# EAGLE design Volt Shield 1.0 (EAGLE 5.11)

## Sheet 1 of 3
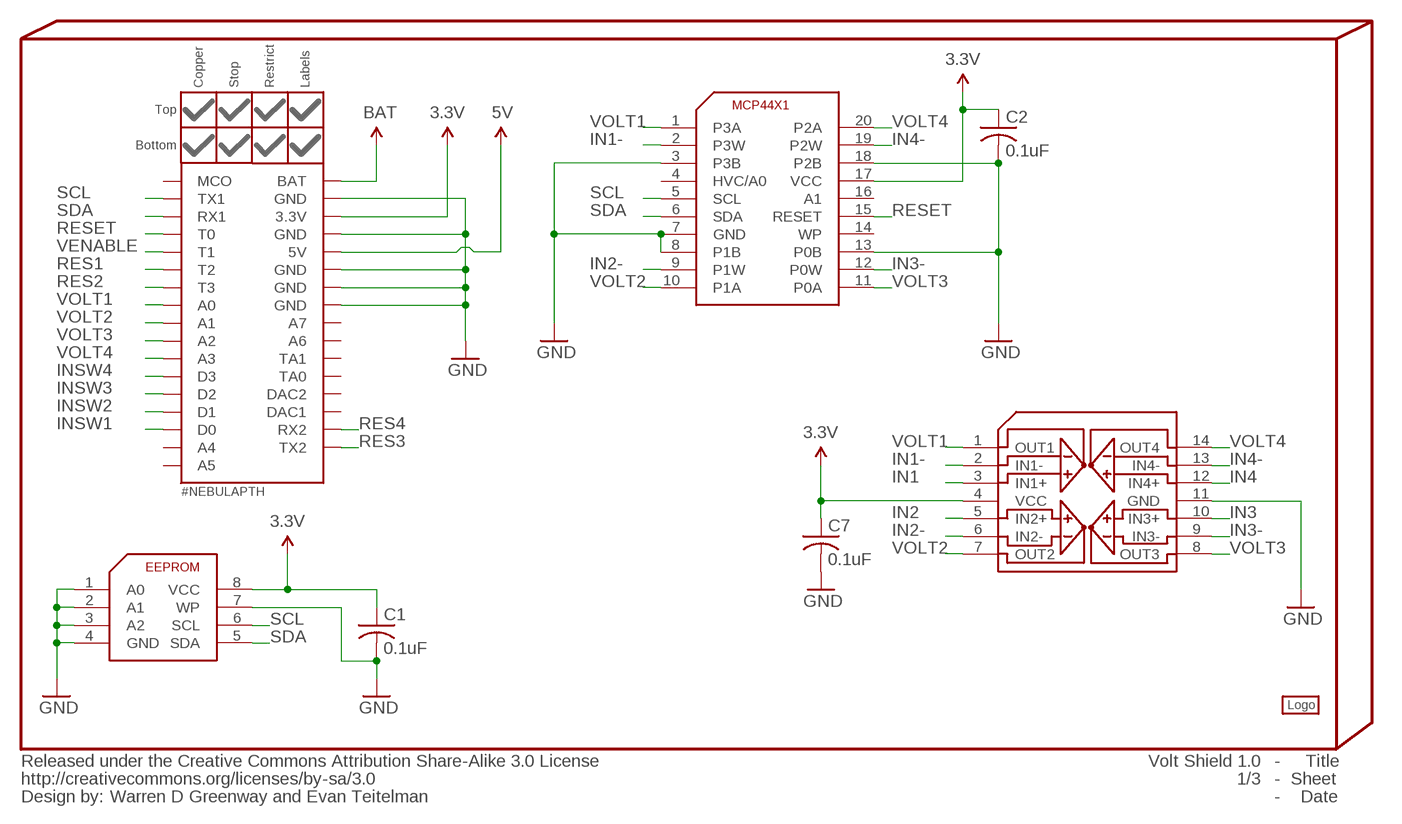
[diagram p0: schematic, sheet 1]

### Parts
C1  0.1uF  C-USC0402  [C0402]
C2  0.1uF  C-USC0402  [C0402]
C7  0.1uF  C-USC0402  [C0402]
INFO2  Warren D Greenway and Evan Teitelman  %CC-BY-SA  [%CC-BY-SA]
LOGO1  #PYGMYLOGONORMAL  #PYGMYLOGOLARGE  [#PYGMYLOGO]
NEBULA1  #NEBULAPTH  [#NEBULA-PTH]
U2  DIGIPOT-MCP44X1  [TSSOP20]
U3  EEPROM-ATMEL-AT24HC02B  [TSSOP8]
U8  OPAMP-ST-LMV324ID  [SO-14]

### Nets
3.3V: C1.1 C2.1 C7.1 NEBULA1.3.3V U2.17(VCC) U3.8(VCC) U8.4(VCC) ; supply symbol labelled @3.3V ; also sheet 2
5V: NEBULA1.5V ; supply symbol labelled @5V
BAT: NEBULA1.BAT ; supply symbol labelled @BAT ; also sheet 3
GND: C1.2 C2.2 C7.2 NEBULA1.GND1(GND) NEBULA1.GND2(GND) NEBULA1.GND3(GND) NEBULA1.GND4(GND) NEBULA1.GND5(GND) U2.3(P3B) U2.7(GND) U2.8(P1B) U2.13(P0B) U2.18(P2B) U3.1(A0) U3.2(A1) U3.3(A2) U3.4(GND) U3.7(WP) U8.11(GND) ; supply symbol labelled @GND ; also sheet 2,3
IN1: U8.3(IN1+) ; also sheet 2
IN1-: U2.2(P3W) U8.2(IN1-)
IN2: U8.5(IN2+) ; also sheet 2
IN2-: U2.9(P1W) U8.6(IN2-)
IN3: U8.10(IN3+) ; also sheet 2
IN3-: U2.12(P0W) U8.9(IN3-)
IN4: U8.12(IN4+) ; also sheet 2
IN4-: U2.19(P2W) U8.13(IN4-)
INSW1: NEBULA1.D0 ; also sheet 2
INSW2: NEBULA1.D1 ; also sheet 2
INSW3: NEBULA1.D2 ; also sheet 2
INSW4: NEBULA1.D3 ; also sheet 2
RES1: NEBULA1.T2 ; also sheet 2
RES2: NEBULA1.T3 ; also sheet 2
RES3: NEBULA1.COM2_TX(TX2) ; also sheet 2
RES4: NEBULA1.COM2_RX(RX2) ; also sheet 2
RESET: NEBULA1.T0 U2.15(RESET)
SCL: NEBULA1.COM1_TX(TX1) U2.5(SCL) U3.6(SCL)
SDA: NEBULA1.COM1_RX(RX1) U2.6(SDA) U3.5(SDA)
VENABLE: NEBULA1.T1 ; also sheet 3
VOLT1: NEBULA1.A0 U2.1(P3A) U8.1(OUT1)
VOLT2: NEBULA1.A1 U2.10(P1A) U8.7(OUT2)
VOLT3: NEBULA1.A2 U2.11(P0A) U8.8(OUT3)
VOLT4: NEBULA1.A3 U2.20(P2A) U8.14(OUT4)
Unconnected: NEBULA1.A4 NEBULA1.A5 NEBULA1.A6 NEBULA1.A7 NEBULA1.DAC1 NEBULA1.DAC2 NEBULA1.MCO NEBULA1.TA0 NEBULA1.TA1 U2.4(HVC/A0) U2.14(WP) U2.16(A1)

## Sheet 2 of 3
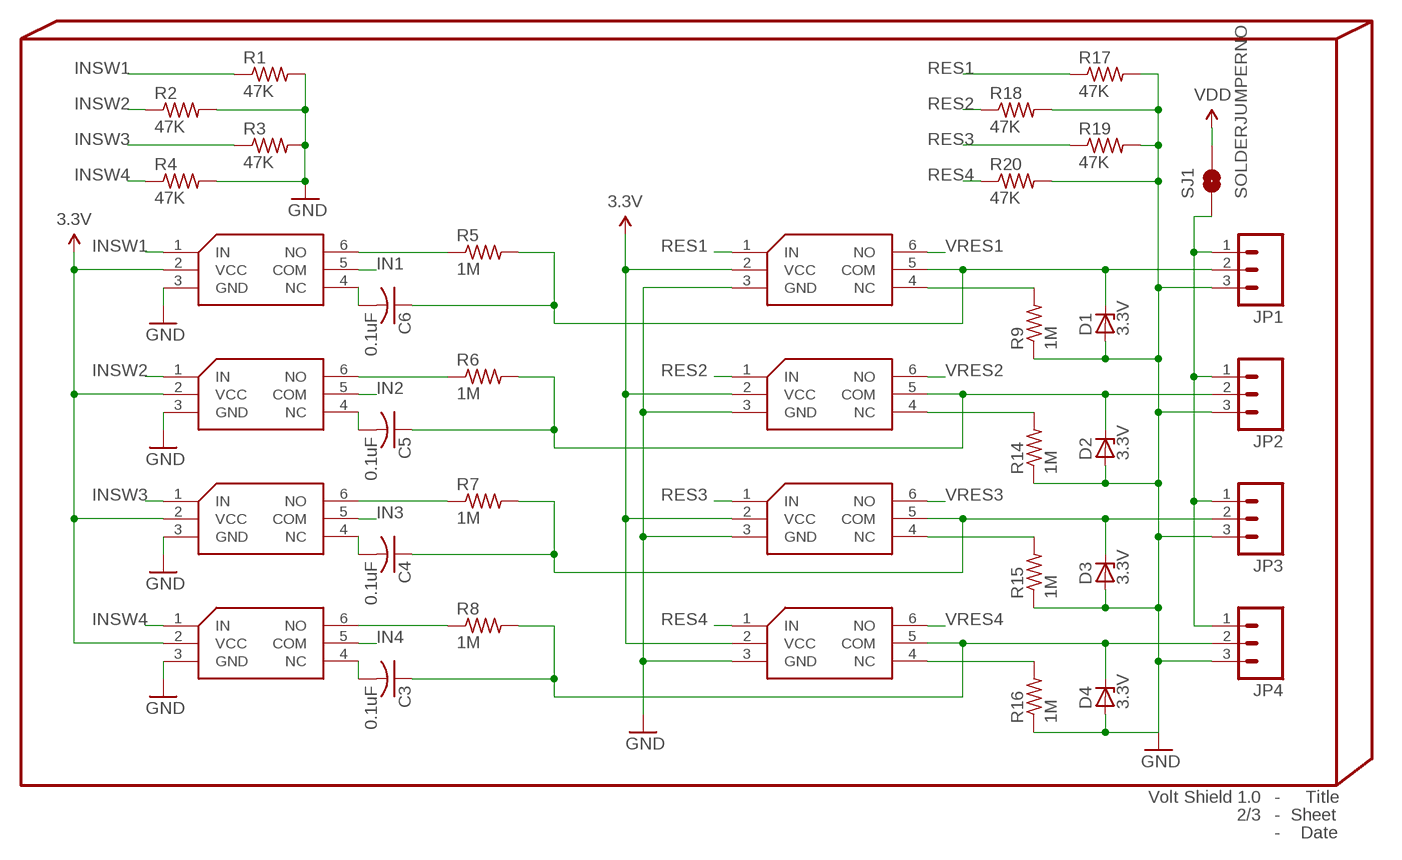
[diagram p1: schematic, sheet 2]

### Parts
C3  0.1uF  C-USC0402  [C0402]
C4  0.1uF  C-USC0402  [C0402]
C5  0.1uF  C-USC0402  [C0402]
C6  0.1uF  C-USC0402  [C0402]
D1  3.3V  ZENER-DIODESOD80C  [SOD80C]
D2  3.3V  ZENER-DIODESOD80C  [SOD80C]
D3  3.3V  ZENER-DIODESOD80C  [SOD80C]
D4  3.3V  ZENER-DIODESOD80C  [SOD80C]
JP1  M03JST-PTH  [JST-3-PTH]
JP2  M03JST-PTH  [JST-3-PTH]
JP3  M03JST-PTH  [JST-3-PTH]
JP4  M03JST-PTH  [JST-3-PTH]
R1  47K  R-US_R0402  [R0402]
R2  47K  R-US_R0402  [R0402]
R3  47K  R-US_R0402  [R0402]
R4  47K  R-US_R0402  [R0402]
R5  1M  R-US_R0402  [R0402]
R6  1M  R-US_R0402  [R0402]
R7  1M  R-US_R0402  [R0402]
R8  1M  R-US_R0402  [R0402]
R9  1M  R-US_R0402  [R0402]
R14  1M  R-US_R0402  [R0402]
R15  1M  R-US_R0402  [R0402]
R16  1M  R-US_R0402  [R0402]
R17  47K  R-US_R0402  [R0402]
R18  47K  R-US_R0402  [R0402]
R19  47K  R-US_R0402  [R0402]
R20  47K  R-US_R0402  [R0402]
SJ1  SOLDERJUMPERNO  [SJ_2S-NO]
U4  MULTIPLEXER-TI-TS5A4624  [SC70-6L]
U5  MULTIPLEXER-TI-TS5A4624  [SC70-6L]
U6  MULTIPLEXER-TI-TS5A4624  [SC70-6L]
U7  MULTIPLEXER-TI-TS5A4624  [SC70-6L]
U9  MULTIPLEXER-TI-TS5A4624  [SC70-6L]
U10  MULTIPLEXER-TI-TS5A4624  [SC70-6L]
U11  MULTIPLEXER-TI-TS5A4624  [SC70-6L]
U12  MULTIPLEXER-TI-TS5A4624  [SC70-6L]

### Nets
3.3V: U4.2(VCC) U5.2(VCC) U6.2(VCC) U7.2(VCC) U9.2(VCC) U10.2(VCC) U11.2(VCC) U12.2(VCC) ; supply symbol labelled @3.3V ; also sheet 1
GND: D1.A D2.A D3.A D4.A JP1.3 JP2.3 JP3.3 JP4.3 R1.2 R2.2 R3.2 R4.2 R9.1 R14.1 R15.1 R16.1 R17.2 R18.2 R19.2 R20.2 U4.3(GND) U5.3(GND) U6.3(GND) U7.3(GND) U9.3(GND) U10.3(GND) U11.3(GND) U12.3(GND) ; supply symbol labelled @GND ; also sheet 1,3
IN1: U4.5(COM) ; also sheet 1
IN2: U5.5(COM) ; also sheet 1
IN3: U6.5(COM) ; also sheet 1
IN4: U7.5(COM) ; also sheet 1
INSW1: R1.1 U4.1(IN) ; also sheet 1
INSW2: R2.1 U5.1(IN) ; also sheet 1
INSW3: R3.1 U6.1(IN) ; also sheet 1
INSW4: R4.1 U7.1(IN) ; also sheet 1
N$1: R5.1 U4.6(NO)
N$2: R6.1 U5.6(NO)
N$3: R7.1 U6.6(NO)
N$4: R8.1 U7.6(NO)
N$5: C3.2 U7.4(NC)
N$6: C4.2 U6.4(NC)
N$7: C6.1 D1.C JP1.2 R5.2 U9.5(COM)
N$8: JP1.1 JP2.1 JP3.1 JP4.1 SJ1.1
N$9: C5.1 D2.C JP2.2 R6.2 U10.5(COM)
N$12: C5.2 U5.4(NC)
N$13: C6.2 U4.4(NC)
N$16: C4.1 D3.C JP3.2 R7.2 U11.5(COM)
N$18: R16.2 U12.4(NC)
N$19: R15.2 U11.4(NC)
N$20: R14.2 U10.4(NC)
N$21: R9.2 U9.4(NC)
N$22: C3.1 D4.C JP4.2 R8.2 U12.5(COM)
RES1: R17.1 U9.1(IN) ; also sheet 1
RES2: R18.1 U10.1(IN) ; also sheet 1
RES3: R19.1 U11.1(IN) ; also sheet 1
RES4: R20.1 U12.1(IN) ; also sheet 1
VDD: SJ1.2 ; supply symbol labelled @VDD ; also sheet 3
VRES1: U9.6(NO) ; also sheet 3
VRES2: U10.6(NO) ; also sheet 3
VRES3: U11.6(NO) ; also sheet 3
VRES4: U12.6(NO) ; also sheet 3

## Sheet 3 of 3
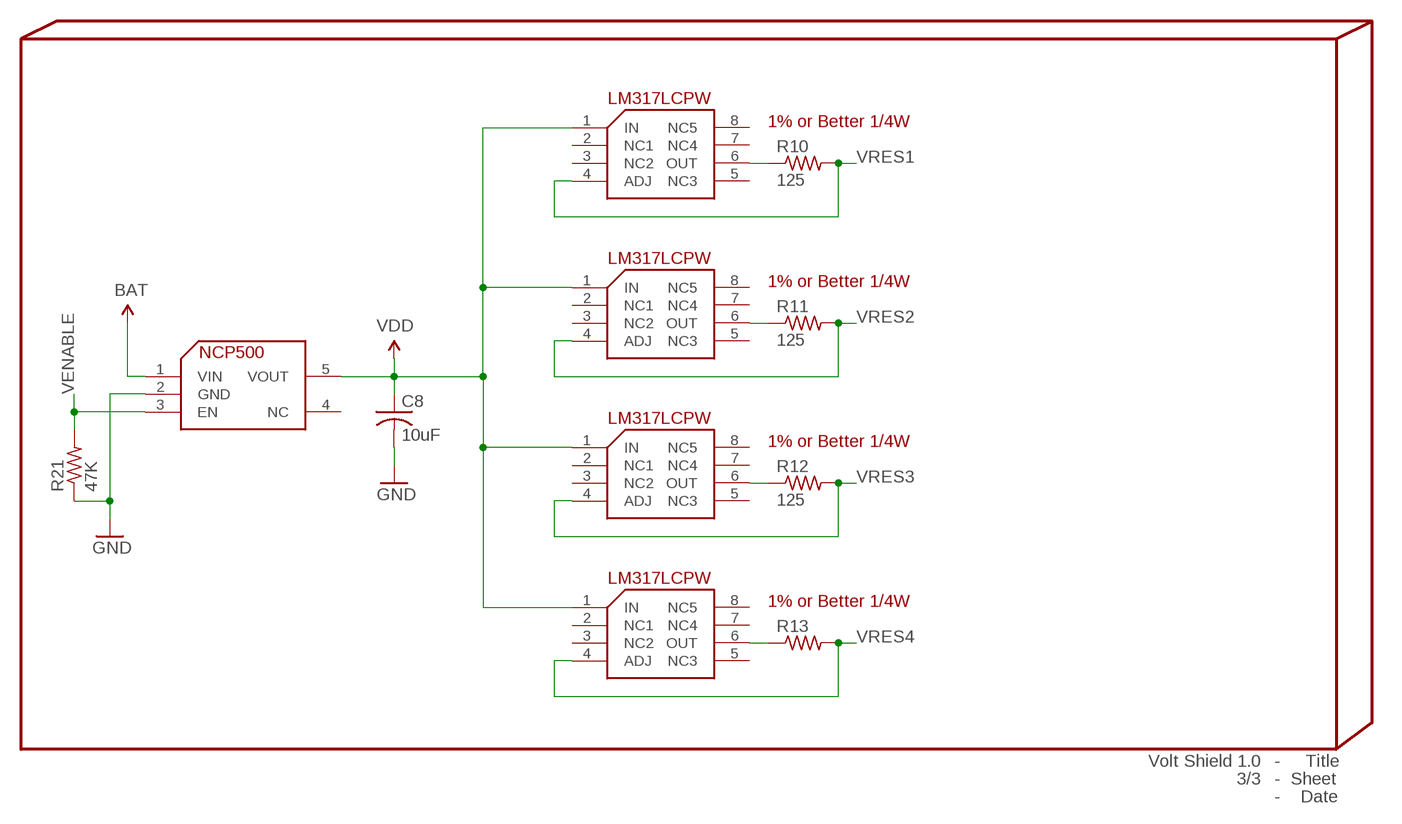
[diagram p2: schematic, sheet 3]

### Parts
C8  10uF  C-USC0805  [C0805]
R10  125  R-US_R1206  [R1206]
R11  125  R-US_R1206  [R1206]
R12  125  R-US_R1206  [R1206]
R13  R-US_R1206  [R1206]
R21  47K  R-US_R0402  [R0402]
U$13  NCP500  [SOT23-5L]
U$14  REGULATOR-TI-LM317LCPW  [TSSOP8]
U$15  REGULATOR-TI-LM317LCPW  [TSSOP8]
U$16  REGULATOR-TI-LM317LCPW  [TSSOP8]
U$17  REGULATOR-TI-LM317LCPW  [TSSOP8]

### Nets
BAT: U$13.1(VIN) ; supply symbol labelled @BAT ; also sheet 1
GND: C8.2 R21.1 U$13.2(GND) ; supply symbol labelled @GND ; also sheet 1,2
N$10: R10.1 U$14.6(OUT)
N$11: R11.1 U$15.6(OUT)
N$14: R12.1 U$16.6(OUT)
N$15: R13.1 U$17.6(OUT)
VDD: C8.1 U$13.5(VOUT) U$14.1(IN) U$15.1(IN) U$16.1(IN) U$17.1(IN) ; supply symbol labelled @VDD ; also sheet 2
VENABLE: R21.2 U$13.3(EN) ; also sheet 1
VRES1: R10.2 U$14.4(ADJ) ; also sheet 2
VRES2: R11.2 U$15.4(ADJ) ; also sheet 2
VRES3: R12.2 U$16.4(ADJ) ; also sheet 2
VRES4: R13.2 U$17.4(ADJ) ; also sheet 2
Unconnected: U$13.4(NC) U$14.2(NC1) U$14.3(NC2) U$14.5(NC3) U$14.7(NC4) U$14.8(NC5) U$15.2(NC1) U$15.3(NC2) U$15.5(NC3) U$15.7(NC4) U$15.8(NC5) U$16.2(NC1) U$16.3(NC2) U$16.5(NC3) U$16.7(NC4) U$16.8(NC5) U$17.2(NC1) U$17.3(NC2) U$17.5(NC3) U$17.7(NC4) U$17.8(NC5)

### Notes on the sheet
- 1% or Better 1/4W
- 1% or Better 1/4W
- 1% or Better 1/4W
- 1% or Better 1/4W

## Library data of the parts
C1-C8 = rcl:C-US: CAPACITOR, American symbol
D1-D4 = diode:ZENER-DIODE: Z-Diode
INFO2 = PygmyBoards:%CC-BY-SA: Creative Commons Attribution-ShareAlike License <http://creativecommons.org/licenses/by-sa/3.0/>
JP1-JP4 = Pygmy:M03: Header 3 Standard 3-pin 0.1" header. Use with straight break away headers (SKU : PRT-00116), right angle break away headers (PRT-00553), swiss pins (PRT-00743), machine pins (PRT-00117), and female headers (PRT-00115). Molex polarized connector foot print use with SKU : PRT-08232 with associated crimp pins and housings.
LOGO1 = Pygmy:#PYGMYLOGO
NEBULA1 = PygmyBoards:#NEBULA: Nebula Board and Shield Footprint Pads This is the only absolutely required part for the footprint. The parts in "#NEBULA-PART" are merely aesthetic. A circular board outline should be .001" thick and 1.005" in diameter (Reference circle on the Document (48) layer provided).
R1-R21 = rcl:R-US_: RESISTOR, American symbol
SJ1 = Pygmy:SOLDERJUMPER: Solder Jumper Standard SMD solder jumper. Used to automate production. Two varients : Normally Open and Normally Closed are the same, but have different paste layers. NC will have a large amount of paste and should jumper during reflow.
U2 = Pygmy:DIGIPOT-MCP44X1
U3 = Pygmy:EEPROM-ATMEL-AT24HC02B
U4-U7 U9-U12 = Pygmy:MULTIPLEXER-TI-TS5A4624
U8 = Pygmy:OPAMP-ST-LMV324ID
U$13 = Pygmy:NCP500
U$14-U$17 = Pygmy:REGULATOR-TI-LM317LCPW

## Board
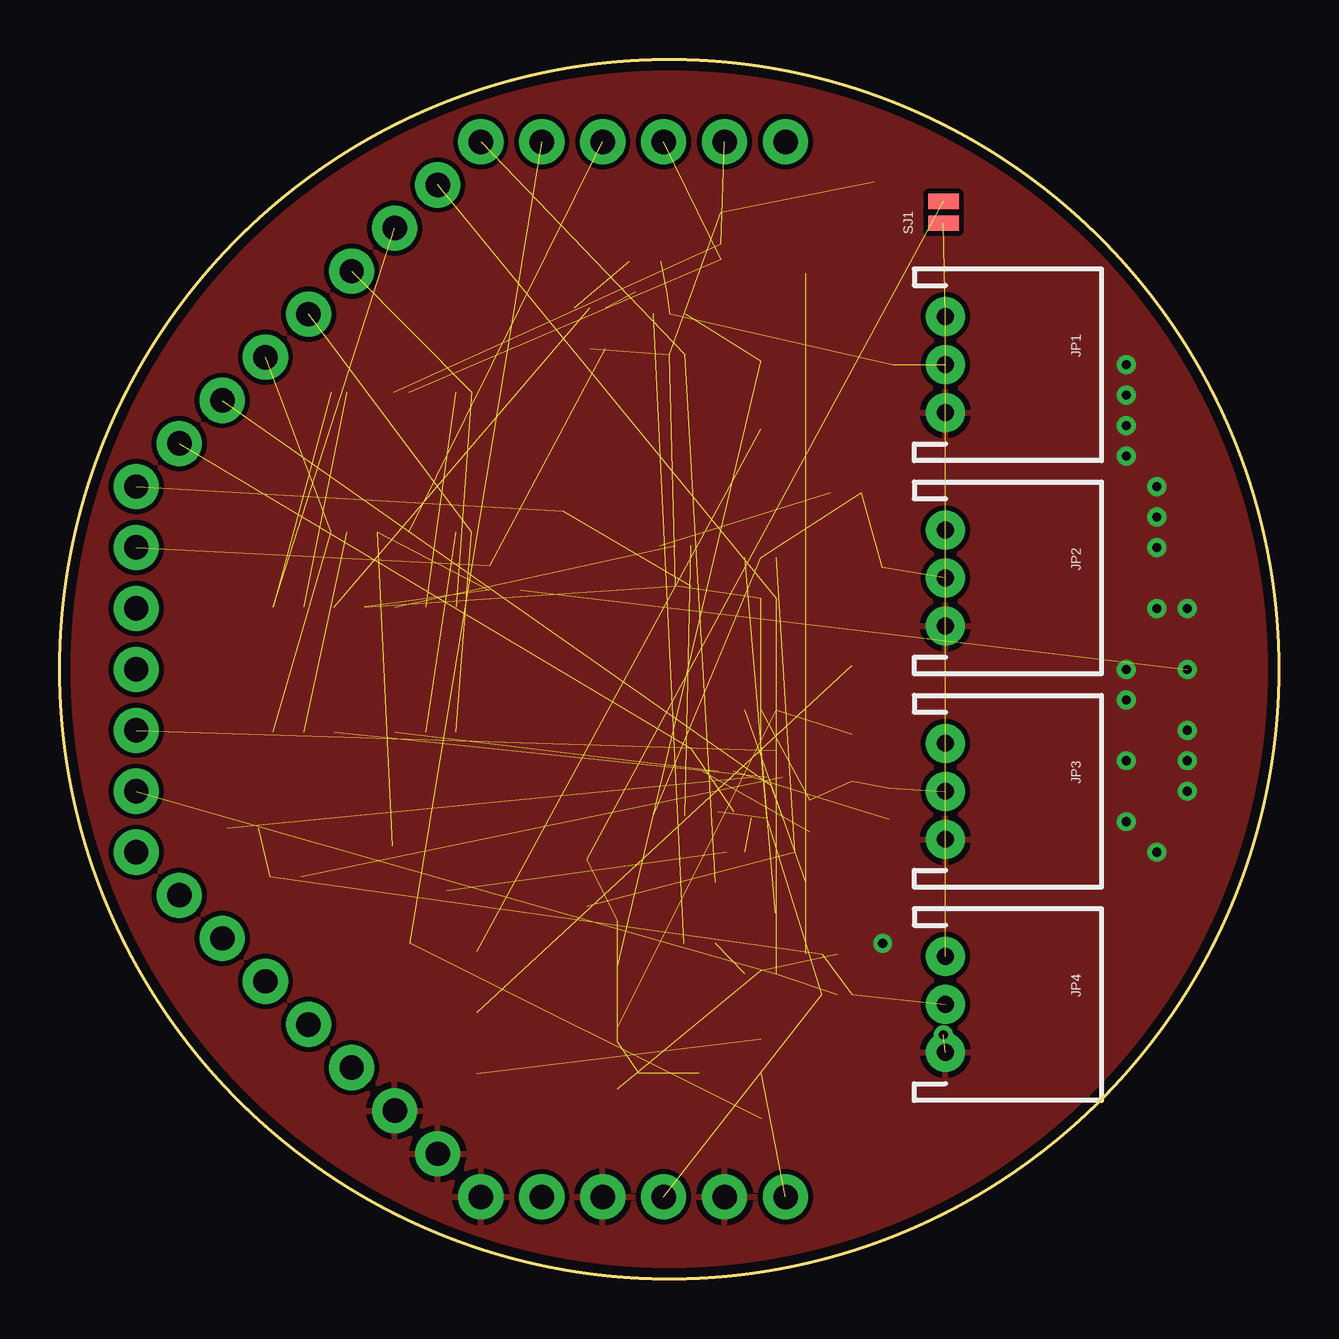
[diagram p3: board, top side]
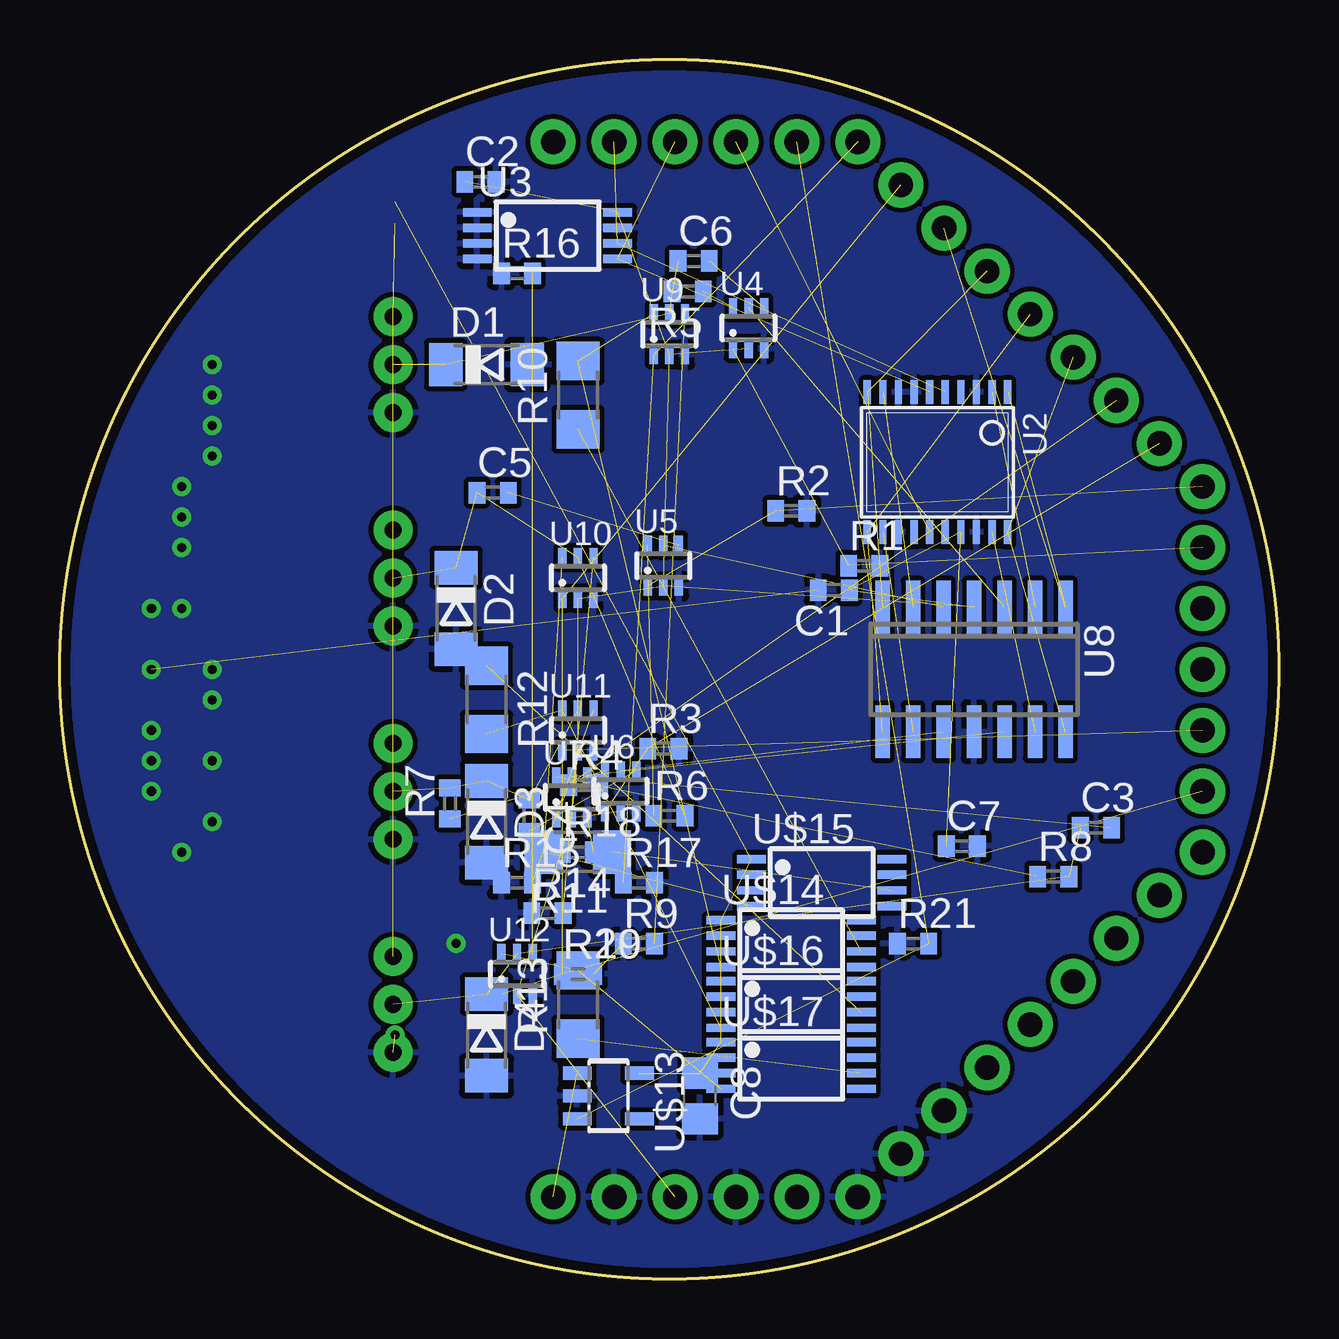
[diagram p4: board, bottom side, seen from below]

Size 50.8 x 50.8 mm. Coordinates in mm from the lower left corner, seen from the top.
Outline: circle at 25.4,25.4 radius 25.4
Copper layers (1*16): Top 0.035mm / dielectric 1.5mm / Bottom 0.035mm
Design rules "PDX (Production)": minimum track width 6mil, minimum drill 15mil, track to track 6mil, track to pad 6mil, pad to pad 4mil, via to via 6mil, smd to smd 4mil, copper to edge 15mil, drill to drill 6mil, minimum pad ring 10mil, minimum via ring 8mil, stop-mask expansion 4mil, vias tented up to drill 25mil, thermal gap 10mil

### Footprints (pad centres in the part's own frame; a part is rotated, then mirrored left to right if it is on the bottom)
C0402 = smd 0.7 x 0.9: 1 -0.65,0; 2 0.65,0
C0805 = smd 1.3 x 1.5: 1 -0.95,0; 2 0.95,0
SOD80C = smd 1.4 x 1.8: A 1.7,0; C -1.7,0
JST-3-PTH = drill 0.7 pad 1.626 round: 1 -2,-5; 2 0,-5; 3 2,-5
#NEBULA-PTH@1 = drill 1.016 pad 1.88 round: 3.3V -25.637,-47.388; 5V -30.716,-47.388; A0 -36.848,-7.004; A1 -38.645,-8.8; A2 -40.44,-10.596; A3 -42.237,-12.392; A4 -47.625,-22.86; A5 -47.625,-25.4; A6 -40.44,-40.204; A7 -38.645,-42; BAT -20.557,-47.388; COM1_RX -25.636,-3.412; COM1_TX -23.096,-3.412; COM2_RX -47.625,-30.48; COM2_TX -47.625,-27.94; D0 -47.625,-20.32; D1 -47.625,-17.78; D2 -45.829,-15.984; D3 -44.032,-14.188; DAC1 -47.625,-33.02; DAC2 -45.829,-34.816; GND1 -36.848,-43.796; GND2 -35.052,-45.592; GND3 -33.256,-47.388; GND4 -28.177,-47.388; GND5 -23.097,-47.388; MCO -20.556,-3.412; T0 -28.176,-3.412; T1 -30.716,-3.412; T2 -33.256,-3.412; T3 -35.052,-5.208; TA0 -44.032,-36.612; TA1 -42.237,-38.408
R0402 = smd 0.7 x 0.9: 1 -0.65,0; 2 0.65,0
R1206 = smd 1.6 x 1.803: 1 -1.422,0; 2 1.422,0
SJ_2S-NO = smd 0.635 x 1.27: 1 -0.45,0; 2 0.45,0
TSSOP20 = smd 0.305 x 0.991: 1 -2.925,-2.918; 2 -2.275,-2.918; 3 -1.625,-2.918; 4 -0.975,-2.918; 5 -0.325,-2.918; 6 0.325,-2.918; 7 0.975,-2.918; 8 1.625,-2.918; 9 2.275,-2.918; 10 2.925,-2.918; 11 2.925,2.918; 12 2.275,2.918; 13 1.625,2.918; 14 0.975,2.918; 15 0.325,2.918; 16 -0.325,2.918; 17 -0.975,2.918; 18 -1.625,2.918; 19 -2.275,2.918; 20 -2.925,2.918
TSSOP8 = smd 1.2 x 0.35: 1 -2.925,0.975; 2 -2.925,0.325; 3 -2.925,-0.325; 4 -2.925,-0.975; 5 2.925,-0.975; 6 2.925,-0.325; 7 2.925,0.325; 8 2.925,0.975
SC70-6L = smd 0.35 x 0.8: 1 -0.65,-0.85; 2 0,-0.85; 3 0.65,-0.85; 4 0.65,0.85; 5 0,0.85; 6 -0.65,0.85
SO-14 = smd 0.6 x 2.2: 1 -3.81,-2.6; 2 -2.54,-2.6; 3 -1.27,-2.6; 4 0,-2.6; 5 1.27,-2.6; 6 2.54,-2.6; 7 3.81,-2.6; 8 3.81,2.6; 9 2.54,2.6; 10 1.27,2.6; 11 0,2.6; 12 -1.27,2.6; 13 -2.54,2.6; 14 -3.81,2.6
SOT23-5L = smd 0.55 x 1.2: 1 -0.95,-1.3; 2 0,-1.3; 3 0.95,-1.3; 4 0.95,1.3; 5 -0.95,1.3

### Placement (x,y rotation side)
C1  18.54,28.7 180 bottom
C2  33.27,45.72 0 bottom
C3  7.62,18.8 0 bottom
C4  31.24,19.3 270 bottom
C5  32.77,32.77 0 bottom
C6  24.38,42.42 0 bottom
C7  13.21,18.03 0 bottom
C8  24.13,7.62 270 bottom
D1  33.02,38.1 0 bottom
D2  34.29,27.94 270 bottom
D3  33.02,19.05 270 bottom
D4  33.02,10.16 270 bottom
INFO2  Warren D Greenway and Evan Teitelman  [%CC-BY-SA@1]  -2.54,-10.16 0 top  (outside the outline)
JP1  41.91,38.1 270 top
JP2  41.91,29.21 270 top
JP3  41.91,20.32 270 top
JP4  41.91,11.43 270 top
LOGO1  10.16,25.15 270 top
NEBULA1  #NEBULAPTH  [#NEBULA-PTH@1]  50.8,50.8 0 top
R1  17.27,29.72 0 bottom
R2  20.32,32 0 bottom
R3  25.65,22.1 0 bottom
R4  28.96,20.57 0 bottom
R5  24.64,41.15 180 bottom
R6  25.4,19.3 0 bottom
R7  34.54,19.81 90 bottom
R8  9.4,16.76 0 bottom
R9  26.67,13.97 0 bottom
R10  29.21,36.83 90 bottom
R11  29.21,17.78 180 bottom
R12  33.02,24.13 270 bottom
R13  29.21,11.43 90 bottom
R14  30.48,15.24 0 bottom
R15  31.75,16.51 0 bottom
R16  31.75,41.91 0 bottom
R17  26.67,16.51 0 bottom
R18  29.21,17.78 0 bottom
R19  29.21,12.7 0 bottom
R20  29.21,12.7 0 bottom
R21  15.24,13.97 0 bottom
SJ1  36.83,44.45 90 top
U2  14.22,34.04 180 bottom
U3  30.48,43.48 0 bottom
U4  22.1,39.62 0 bottom
U5  25.65,29.72 0 bottom
U6  27.43,20.32 0 bottom
U7  29.46,20.07 0 bottom
U8  12.7,25.4 180 bottom
U9  25.4,39.37 0 bottom
U10  29.21,29.21 0 bottom
U11  29.21,22.86 0 bottom
U12  31.75,12.7 0 bottom
U$13  27.94,7.62 270 bottom
U$14  20.32,13.97 0 bottom
U$15  19.05,16.51 0 bottom
U$16  20.32,11.43 0 bottom
U$17  20.32,8.89 0 bottom

### Tracks (layer width: path | path; a pad name or v marks a point on that pad's centre or on a via)
3.3V  (14 unrouted)
BAT  (1 unrouted)
GND  (via drill 0.38)  (4 unrouted)
  other vias: 36.83,10.16 46.99,22.86 46.99,27.94 44.45,19.05 46.99,20.32 45.72,17.78 46.99,25.4 45.72,30.48 46.99,21.59 45.72,27.94 44.45,38.1 44.45,36.83 44.45,35.56 45.72,33.02 44.45,34.29 44.45,25.4 44.45,24.13 44.45,21.59 34.29,13.97 45.72,31.75
  pour Bottom (isolate 0.203): -2.54,-2.54 53.34,-2.54 53.34,53.34 -2.54,53.34
  pour Top (isolate 0.203): -1.27,-1.27 52.07,-1.27 52.07,52.07 -1.27,52.07
IN1  (1 unrouted)
IN1-  (1 unrouted)
IN2  (1 unrouted)
IN2-  (1 unrouted)
IN3  (1 unrouted)
IN3-  (1 unrouted)
IN4  (1 unrouted)
IN4-  (1 unrouted)
INSW1  (2 unrouted)
INSW2  (2 unrouted)
INSW3  (2 unrouted)
INSW4  (2 unrouted)
N$1  (1 unrouted)
N$2  (1 unrouted)
N$3  (1 unrouted)
N$4  (1 unrouted)
N$5  (1 unrouted)
N$6  (1 unrouted)
N$7  (4 unrouted)
N$8  (4 unrouted)
N$9  (4 unrouted)
N$10  (1 unrouted)
N$11  (1 unrouted)
N$12  (1 unrouted)
N$13  (1 unrouted)
N$14  (1 unrouted)
N$15  (1 unrouted)
N$16  (4 unrouted)
N$18  (1 unrouted)
N$19  (1 unrouted)
N$20  (1 unrouted)
N$21  (1 unrouted)
N$22  (4 unrouted)
RES1  (2 unrouted)
RES2  (2 unrouted)
RES3  (2 unrouted)
RES4  (2 unrouted)
RESET  (1 unrouted)
SCL  (2 unrouted)
SDA  (2 unrouted)
VDD  (6 unrouted)
VENABLE  (2 unrouted)
VOLT1  (2 unrouted)
VOLT2  (2 unrouted)
VOLT3  (2 unrouted)
VOLT4  (2 unrouted)
VRES1  (2 unrouted)
VRES2  (2 unrouted)
VRES3  (2 unrouted)
VRES4  (2 unrouted)

### Text on the board
bTest: Designed By: | Warren D Greenway | Evan Teitelman | Pygmy Motion Shield | V1.0
Document: Pygmy Volt Shield | Version 1.0 | Standard Grid: 50mil | Routing Grids: 8mil / 4mil